# Altium schematic sheet power_amp.SchDoc
size A4
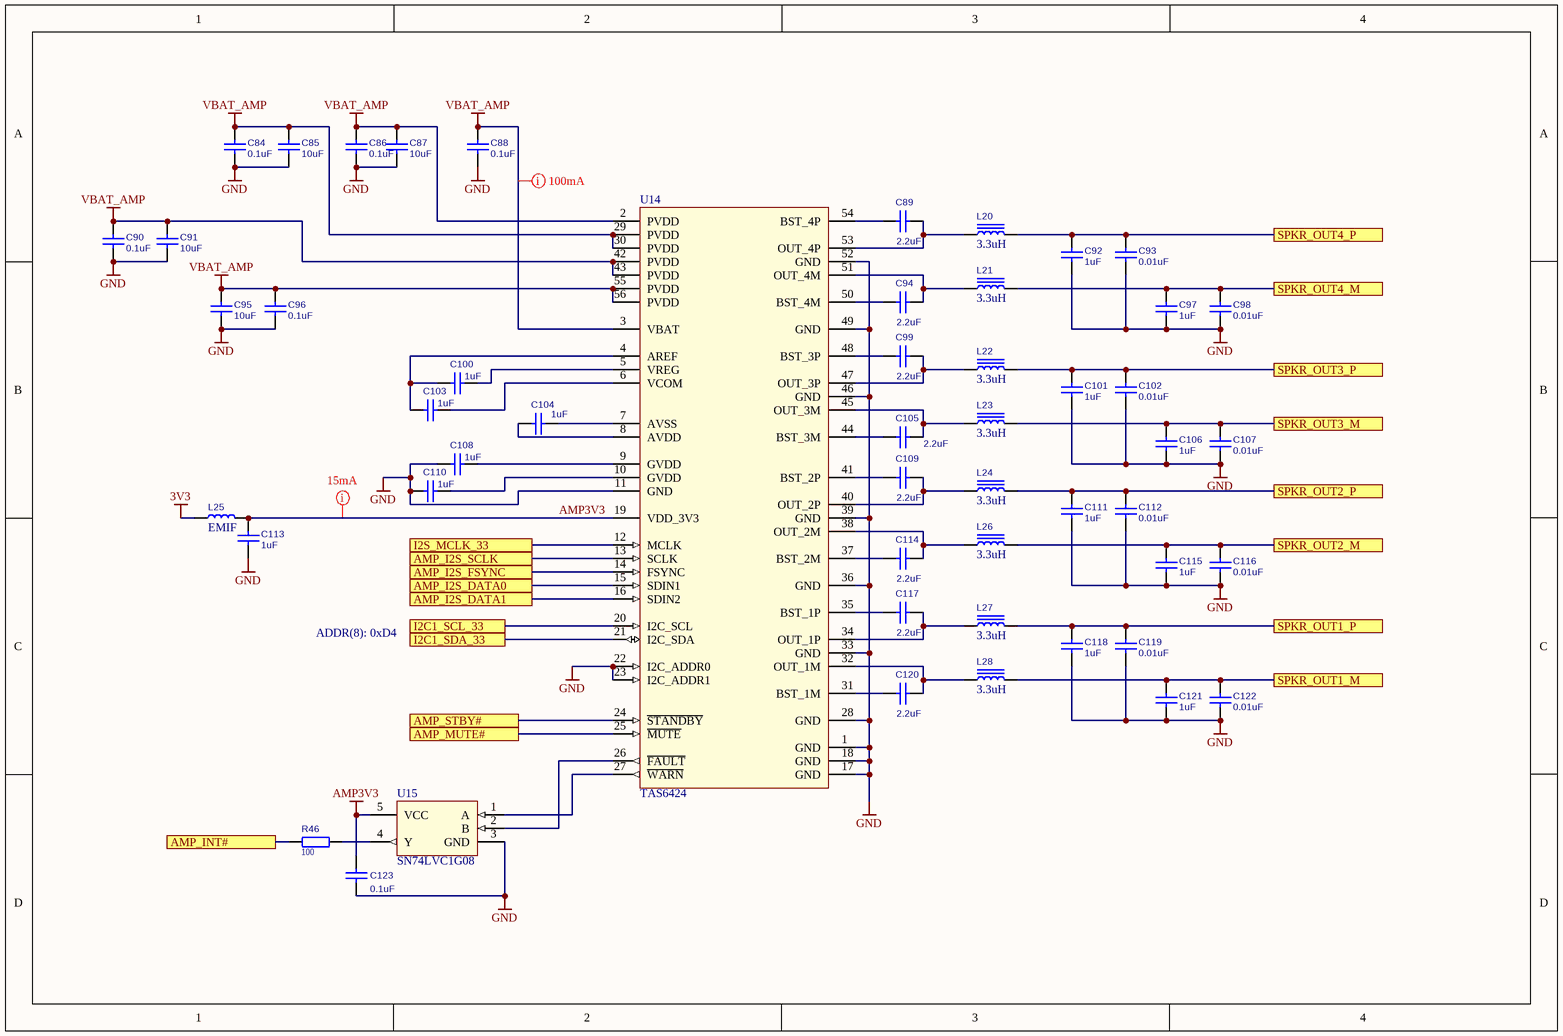
[diagram p0: power_amp.SchDoc]

## Parts
C84  value 0.1uF  [C0603]  (hidden comment: C1608X7R1H104K080AA)
C85  value 10uF  [C0805]  (hidden comment: GRM21BR61E106KA73L)
C86  value 0.1uF  [C0603]  (hidden comment: C1608X7R1H104K080AA)
C87  value 10uF  [C0805]  (hidden comment: GRM21BR61E106KA73L)
C88  value 0.1uF  [C0603]  (hidden comment: C1608X7R1H104K080AA)
C89  value 2.2uF  [C0603]  (hidden comment: GRM188R61H225KE11D)
C90  value 0.1uF  [C0603]  (hidden comment: C1608X7R1H104K080AA)
C91  value 10uF  [C0805]  (hidden comment: GRM21BR61E106KA73L)
C92  value 1uF  [C0603]  (hidden comment: CC0603KRX7R9BB105)
C93  value 0.01uF  [C0603]  (hidden comment: CL10B103KB8NNNC)
C94  value 2.2uF  [C0603]  (hidden comment: GRM188R61H225KE11D)
C95  value 10uF  [C0805]  (hidden comment: GRM21BR61E106KA73L)
C96  value 0.1uF  [C0603]  (hidden comment: C1608X7R1H104K080AA)
C97  value 1uF  [C0603]  (hidden comment: CC0603KRX7R9BB105)
C98  value 0.01uF  [C0603]  (hidden comment: CL10B103KB8NNNC)
C99  value 2.2uF  [C0603]  (hidden comment: GRM188R61H225KE11D)
C100  value 1uF  [C0603]  (hidden comment: CC0603KRX7R9BB105)
C101  value 1uF  [C0603]  (hidden comment: CC0603KRX7R9BB105)
C102  value 0.01uF  [C0603]  (hidden comment: CL10B103KB8NNNC)
C103  value 1uF  [C0603]  (hidden comment: CC0603KRX7R9BB105)
C104  value 1uF  [C0603]  (hidden comment: CC0603KRX7R9BB105)
C105  value 2.2uF  [C0603]  (hidden comment: GRM188R61H225KE11D)
C106  value 1uF  [C0603]  (hidden comment: CC0603KRX7R9BB105)
C107  value 0.01uF  [C0603]  (hidden comment: CL10B103KB8NNNC)
C108  value 1uF  [C0603]  (hidden comment: CC0603KRX7R9BB105)
C109  value 2.2uF  [C0603]  (hidden comment: GRM188R61H225KE11D)
C110  value 1uF  [C0603]  (hidden comment: CC0603KRX7R9BB105)
C111  value 1uF  [C0603]  (hidden comment: CC0603KRX7R9BB105)
C112  value 0.01uF  [C0603]  (hidden comment: CL10B103KB8NNNC)
C113  value 1uF  [C0603]  (hidden comment: CC0603KRX7R9BB105)
C114  value 2.2uF  [C0603]  (hidden comment: GRM188R61H225KE11D)
C115  value 1uF  [C0603]  (hidden comment: CC0603KRX7R9BB105)
C116  value 0.01uF  [C0603]  (hidden comment: CL10B103KB8NNNC)
C117  value 2.2uF  [C0603]  (hidden comment: GRM188R61H225KE11D)
C118  value 1uF  [C0603]  (hidden comment: CC0603KRX7R9BB105)
C119  value 0.01uF  [C0603]  (hidden comment: CL10B103KB8NNNC)
C120  value 2.2uF  [C0603]  (hidden comment: GRM188R61H225KE11D)
C121  value 1uF  [C0603]  (hidden comment: CC0603KRX7R9BB105)
C122  value 0.01uF  [C0603]  (hidden comment: CL10B103KB8NNNC)
C123  value 0.1uF  [C0603]  (hidden comment: CC0603KRX7R9BB104)
L20  value 3.3uH  [IHLP-2525CZ]  (hidden comment: IHLP2525CZER3R3M01)
L21  value 3.3uH  [IHLP-2525CZ]  (hidden comment: IHLP2525CZER3R3M01)
L22  value 3.3uH  [IHLP-2525CZ]  (hidden comment: IHLP2525CZER3R3M01)
L23  value 3.3uH  [IHLP-2525CZ]  (hidden comment: IHLP2525CZER3R3M01)
L24  value 3.3uH  [IHLP-2525CZ]  (hidden comment: IHLP2525CZER3R3M01)
L25  value EMIF  [IND0805]  (hidden comment: BLM21PG221SN1D)
L26  value 3.3uH  [IHLP-2525CZ]  (hidden comment: IHLP2525CZER3R3M01)
L27  value 3.3uH  [IHLP-2525CZ]  (hidden comment: IHLP2525CZER3R3M01)
L28  value 3.3uH  [IHLP-2525CZ]  (hidden comment: IHLP2525CZER3R3M01)
R46  100  [R0603]
U14  TAS6424  [HSSOP-56]
U15  value SN74LVC1G08  [SOT-23-5]  (hidden comment: SN74LVC1G08DBVR)

## Ports
AMP_I2S_DATA0, AMP_I2S_DATA1, AMP_I2S_FSYNC, AMP_I2S_SCLK, AMP_INT#, AMP_MUTE#, AMP_STBY#, I2C1_SCL_33, I2C1_SDA_33, I2S_MCLK_33, SPKR_OUT1_M, SPKR_OUT1_P, SPKR_OUT2_M, SPKR_OUT2_P, SPKR_OUT3_M, SPKR_OUT3_P, SPKR_OUT4_M, SPKR_OUT4_P

## Nets
3V3: L25.2
AMP3V3: C113.1 C123.1 L25.1 U14.19(VDD_3V3) U15.5(VCC)
GND: C84.2 C85.2 C86.2 C87.2 C88.2 C90.2 C91.2 C92.2 C93.2 C95.2 C96.2 C97.2 C98.2 C101.2 C102.2 C106.2 C107.2 C108.1 C110.1 C111.2 C112.2 C113.2 C115.2 C116.2 C118.2 C119.2 C121.2 C122.2 C123.2 U14.1(GND) U14.11(GND) U14.17(GND) U14.18(GND) U14.22(I2C_ADDR0) U14.23(I2C_ADDR1) U14.28(GND) U14.33(GND) U14.36(GND) U14.39(GND) U14.46(GND) U14.49(GND) U14.52(GND) U15.3(GND)
VBAT_AMP: C84.1 C85.1 C86.1 C87.1 C88.1 C90.1 C91.1 C95.1 C96.1 U14.2(PVDD) U14.3(VBAT) U14.29(PVDD) U14.30(PVDD) U14.42(PVDD) U14.43(PVDD) U14.55(PVDD) U14.56(PVDD)
AMP_I2S_DATA0: U14.15(SDIN1) ; port AMP_I2S_DATA0
AMP_I2S_DATA1: U14.16(SDIN2) ; port AMP_I2S_DATA1
AMP_I2S_FSYNC: U14.14(FSYNC) ; port AMP_I2S_FSYNC
AMP_I2S_SCLK: U14.13(SCLK) ; port AMP_I2S_SCLK
AMP_INT#: R46.1 ; port AMP_INT#
AMP_MUTE#: U14.25(~{MUTE}) ; port AMP_MUTE#
AMP_STBY#: U14.24(~{STANDBY}) ; port AMP_STBY#
I2C1_SCL_33: U14.20(I2C_SCL) ; port I2C1_SCL_33
I2C1_SDA_33: U14.21(I2C_SDA) ; port I2C1_SDA_33
I2S_MCLK_33: U14.12(MCLK) ; port I2S_MCLK_33
SPKR_OUT1_M: C121.1 C122.1 L28.2 ; port SPKR_OUT1_M
SPKR_OUT1_P: C118.1 C119.1 L27.2 ; port SPKR_OUT1_P
SPKR_OUT2_M: C115.1 C116.1 L26.2 ; port SPKR_OUT2_M
SPKR_OUT2_P: C111.1 C112.1 L24.2 ; port SPKR_OUT2_P
SPKR_OUT3_M: C106.1 C107.1 L23.2 ; port SPKR_OUT3_M
SPKR_OUT3_P: C101.1 C102.1 L22.2 ; port SPKR_OUT3_P
SPKR_OUT4_M: C97.1 C98.1 L21.2 ; port SPKR_OUT4_M
SPKR_OUT4_P: C92.1 C93.1 L20.2 ; port SPKR_OUT4_P
NetC89_1: C89.1 L20.1 U14.53(OUT_4P)
NetC89_2: C89.2 U14.54(BST_4P)
NetC94_1: C94.1 L21.1 U14.51(OUT_4M)
NetC94_2: C94.2 U14.50(BST_4M)
NetC99_1: C99.1 L22.1 U14.47(OUT_3P)
NetC99_2: C99.2 U14.48(BST_3P)
NetC100_1: C100.1 C103.1 U14.4(AREF)
NetC100_2: C100.2 U14.5(VREG)
NetC103_2: C103.2 U14.6(VCOM)
NetC104_1: C104.1 U14.8(AVDD)
NetC104_2: C104.2 U14.7(AVSS)
NetC105_1: C105.1 L23.1 U14.45(OUT_3M)
NetC105_2: C105.2 U14.44(BST_3M)
NetC108_2: C108.2 U14.9(GVDD)
NetC109_1: C109.1 L24.1 U14.40(OUT_2P)
NetC109_2: C109.2 U14.41(BST_2P)
NetC110_2: C110.2 U14.10(GVDD)
NetC114_1: C114.1 L26.1 U14.38(OUT_2M)
NetC114_2: C114.2 U14.37(BST_2M)
NetC117_1: C117.1 L27.1 U14.34(OUT_1P)
NetC117_2: C117.2 U14.35(BST_1P)
NetC120_1: C120.1 L28.1 U14.32(OUT_1M)
NetC120_2: C120.2 U14.31(BST_1M)
NetR46_2: R46.2 U15.4(Y)
NetU14_26: U14.26(~{FAULT}) U15.2(B)
NetU14_27: U14.27(~{WARN}) U15.1(A)

## Layout directives
mark named 15mA: AMP3V3
mark named 100mA: VBAT_AMP

## Notes on the sheet
- ADDR(8): 0xD4

## Library data of the parts
C84-C123 = CAP_NPOL
L20-L24 L26-L28 = IND_W_IRON
L25 = IND_WO_IRON
R46 = RESISTOR: RES; Value: 100
U14 = TAS6424: 75-W, 2-MHz Digital Input 4-Channel Automotive Class-D Audio Amplifier  With Load-Dump Protection and I  2C Diagnostics; value: TAS6424
U15 = SN74LVC1G08